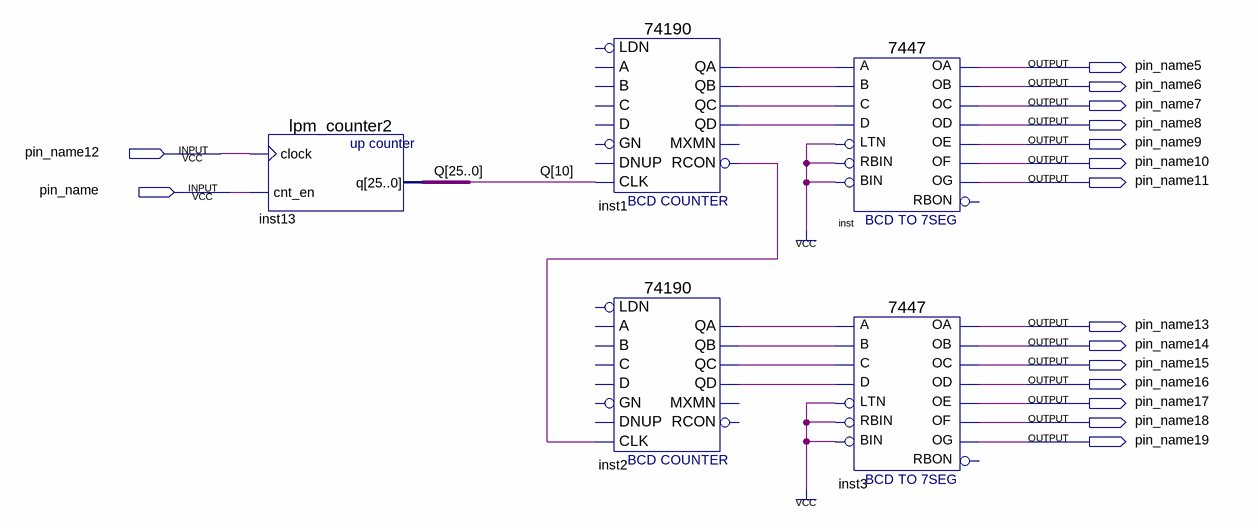
[diagram p0: schematic sheet]
// Quartus schematic Counter8.bdf as structural Verilog: 5 symbols, 16 pins
module Counter8 (
  input  pin_name12,
  input  pin_name,
  output pin_name5,
  output pin_name6,
  output pin_name7,
  output pin_name8,
  output pin_name9,
  output pin_name10,
  output pin_name11,
  output pin_name13,
  output pin_name14,
  output pin_name15,
  output pin_name16,
  output pin_name17,
  output pin_name18,
  output pin_name19
);

  wire inst1_qa, inst1_qb, inst1_qc, inst1_qd, inst1_rcon, inst2_qa, inst2_qb, inst2_qc, inst2_qd;
  wire [25:0] Q;

  lpm_counter2 inst13 (.clock(pin_name12), .cnt_en(pin_name), .q(Q));
  \74190  inst1 (
    .CLK(Q[10]), .QA(inst1_qa), .QB(inst1_qb), .QD(inst1_qd), .QC(inst1_qc), .RCON(inst1_rcon));  // open: LDN, A, C, B, D, GN, DNUP, MXMN
  \74190  inst2 (
    .CLK(inst1_rcon), .QA(inst2_qa), .QB(inst2_qb), .QD(inst2_qd), .QC(inst2_qc));  // open: LDN, A, C, B, D, GN, DNUP, MXMN, RCON
  \7447  inst (
    .LTN(1'b1), .B(inst1_qb), .C(inst1_qc), .D(inst1_qd), .RBIN(1'b1), .BIN(1'b1), .A(inst1_qa),
    .OB(pin_name6), .OC(pin_name7), .OE(pin_name9), .OD(pin_name8), .OF(pin_name10), .OG(pin_name11),
    .OA(pin_name5));  // open: RBON
  \7447  inst3 (
    .LTN(1'b1), .B(inst2_qb), .C(inst2_qc), .D(inst2_qd), .RBIN(1'b1), .BIN(1'b1), .A(inst2_qa),
    .OB(pin_name14), .OC(pin_name15), .OE(pin_name17), .OD(pin_name16), .OF(pin_name18), .OG(pin_name19),
    .OA(pin_name13));  // open: RBON
endmodule
